# EAGLE design bicyclelab-charger (EAGLE 6.2)
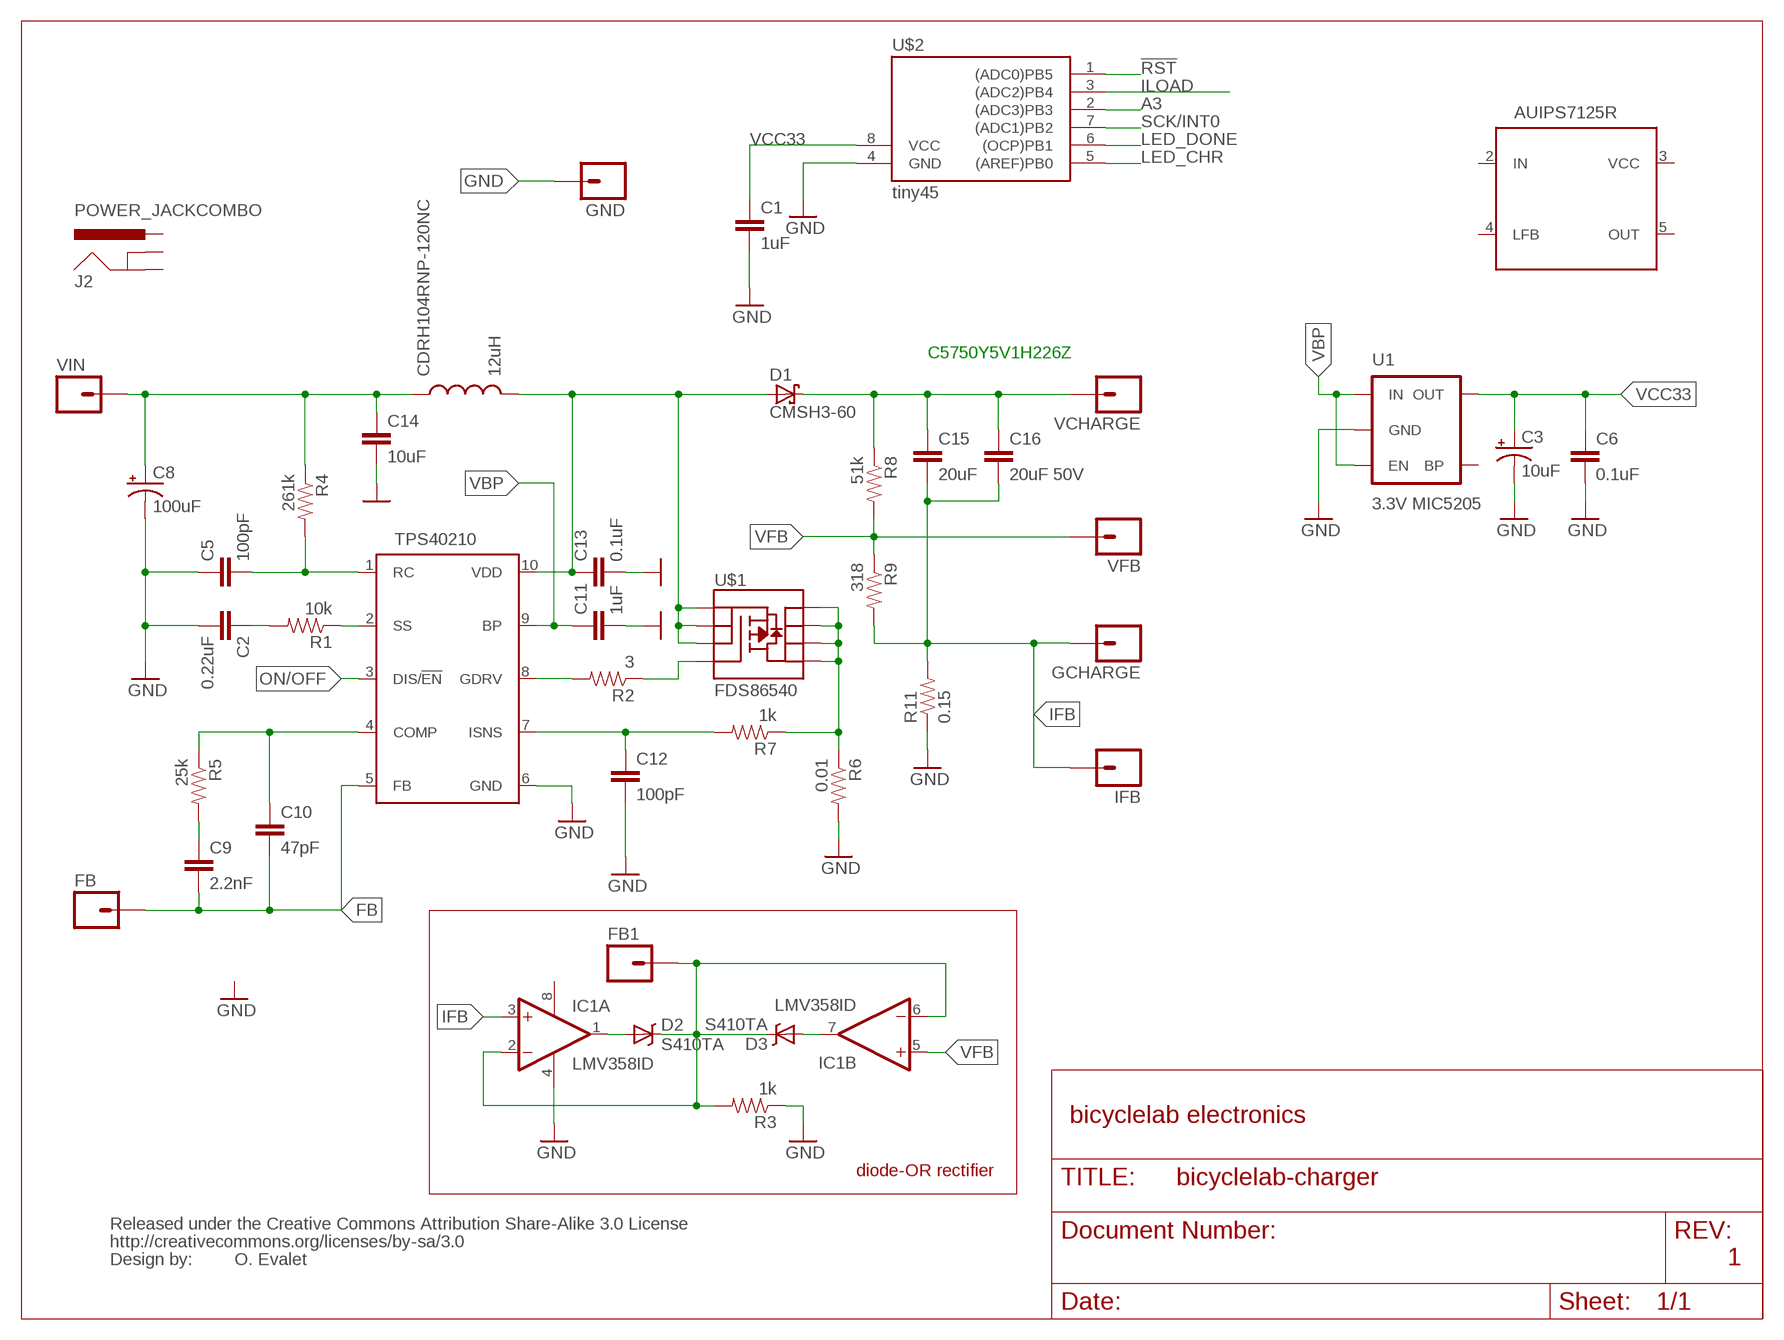
[diagram p0: schematic, sheet 1]

## Parts
11  TPS40211  TPS40210  [MSOP-10-GNDPAD]
C1  1uF  CAP0402-CAP  [0402-CAP]
C2  0.22uF  CAP0402-CAP  [0402-CAP]
C3  10uF  CAP_POL1206  [EIA3216]
C5  100pF  CAP0402-CAP  [0402-CAP]
C6  0.1uF  CAP0603-CAP  [0603-CAP]
C8  100uF  CAP_POLC  [PANASONIC_C]
C9  2.2nF  CAP0402-CAP  [0402-CAP]
C10  47pF  CAP0402-CAP  [0402-CAP]
C11  1uF  CAP0402-CAP  [0402-CAP]
C12  100pF  CAP0402-CAP  [0402-CAP]
C13  0.1uF  CAP0402-CAP  [0402-CAP]
C14  10uF  CAP1206  [1206]
C15  20uF  CAPCAP2220  [C2220K]
C16  20uF 50V  CAPCAP2220  [C2220K]
CDRH104RNP-120NC  12uH  INDUCTORCR75  [CR75]
D1  CMSH3-60  MBRS320T3  [SMC]
D2  S410TA  DIODE-SCHOTTKY  [SOD-323]
D3  S410TA  DIODE-SCHOTTKY  [SOD-323]
FB  M01SMDNS  [1X01NS]
FB1  M01SMDNS  [1X01NS]
GCHARGE  M01SMDNS  [1X01NS]
GND  M01SMDNS  [1X01NS]
IC1  LMV358ID  MCP602SN  [SO08]
IFB  M01SMDNS  [1X01NS]
J2  POWER_JACKCOMBO  [POWER_JACK_COMBO]
R1  10k  RESISTOR0402-RES  [0402-RES]
R2  3  RESISTOR0402-RES  [0402-RES]
R3  1k  RESISTOR0402-RES  [0402-RES]
R4  261k  RESISTOR0402-RES  [0402-RES]
R5  25k  RESISTOR0402-RES  [0402-RES]
R6  0.01  RESISTOR0402-RES  [0402-RES]
R7  1k  RESISTOR0402-RES  [0402-RES]
R8  51k  RESISTOR0402-RES  [0402-RES]
R9  318  RESISTOR0402-RES  [0402-RES]
R11  0.15  RESISTOR0402-RES  [0402-RES]
U1  3.3V MIC5205  V_REG_LDOSMD  [SOT23-5]
U$1  FDS86540  MOSFET-PCHANNEL-SOIC8SOIC8  [SO08]
U$2  tiny45  TINY25/45/85-20SU  [SOIC8]
U$5  CREATIVE_COMMONS  [CREATIVE_COMMONS]
U$8  AUIPS7125R  [DPAK-5]
VCHARGE  M01SMDNS  [1X01NS]
VFB  M01SMDNS  [1X01NS]
VIN  M01SMDNS  [1X01NS]

## Nets
!RST: U$2.1((ADC0)PB5)
A3: U$2.2((ADC3)PB3)
FB: 11.5(FB) C9.2 C10.2 FB.1
FB1: D2.1(C) D3.1(C) FB1.1 IC1.2(A:-IN) IC1.6(B:-IN) R3.2
GND: 11.6(GND) C1.2 C2.2 C3.C(-) C5.1 C6.2 C8.- C11.2 C12.2 C13.2 C14.2 GND.1 IC1.4(P:V-) R3.1 R6.2 R11.1 U1.2(GND) U$2.4(GND)
IFB: C15.2 C16.2 GCHARGE.1 IC1.3(A:+IN) IFB.1 R9.2 R11.2
ILOAD: U$2.3((ADC2)PB4)
LED_CHR: U$2.5((AREF)PB0)
LED_DONE: U$2.6((OCP)PB1)
N$1: C8.+ C14.1 CDRH104RNP-120NC.P$1 R4.1 VIN.1
N$2: 11.1(RC) C5.2 R4.2
N$3: 11.2(SS) R1.1
N$4: C2.1 R1.2
N$5: R2.1 U$1.4(G)
N$6: C15.1 C16.1 D1.C R8.1 VCHARGE.1
N$7: 11.8(GDRV) R2.2
N$8: 11.4(COMP) C10.1 R5.1
N$9: C9.1 R5.2
N$10: D2.2(A) IC1.1(A:OUT)
N$11: 11.10(VDD) C13.1 CDRH104RNP-120NC.P$2 D1.A U$1.1(S) U$1.2(S) U$1.3(S)
N$12: R6.1 R7.1 U$1.5(D) U$1.6(D) U$1.7(D) U$1.8(D)
N$13: 11.7(ISNS) C12.1 R7.2
N$16: D3.2(A) IC1.7(B:OUT)
ON/OFF: 11.3(DIS/!EN)
SCK/INT0: U$2.7((ADC1)PB2)
VBP: 11.9(BP) C11.1 U1.1(IN) U1.3(EN)
VCC33: C1.1 C3.A(+) C6.1 U1.5(OUT) U$2.8(VCC)
VFB: IC1.5(B:+IN) R8.2 R9.1 VFB.1
Unconnected: 11.GND J2.GND(GNDBREAK) J2.GND@1(GND) J2.POWER(PWR) U1.4(BP) U$8.1(NC) U$8.2(IN) U$8.3(VCC) U$8.4(LFB) U$8.5(OUT)

## Notes on the sheet
- C5750Y5V1H226Z
- bicyclelab electronics
- diode-OR rectifier
- O. Evalet | 1

## Power pins joined to a net without a drawn wire
V+: IC1.8(P:V+)

## Library data of the parts
11 = bicyclelab:TPS40210
C1 C2 C5 C6 C9-C13 = SparkFun:CAP: Capacitor Standard 0603 ceramic capacitor, and 0.1" leaded capacitor.
C3 = SparkFun:CAP_POL: Capacitor Polarized These are standard SMD and PTH capacitors. Normally 10uF, 47uF, and 100uF in electrolytic and tantalum varieties. Always verify the external diameter of the through hole cap, it varies with capacity, voltage, and manufacturer. The EIA devices should be standard.
C8 = 0-SparkFun:CAP_POL: Capacitor Polarized These are standard SMD and PTH capacitors. Normally 10uF, 47uF, and 100uF in electrolytic and tantalum varieties. Always verify the external diameter of the through hole cap, it varies with capacity, voltage, and manufacturer. The EIA devices should be standard.
C14 = 0-SparkFun:CAP: Capacitor Standard 0603 ceramic capacitor, and 0.1" leaded capacitor.
C15 C16 = bicyclelab:CAP: Capacitor Standard 0603 ceramic capacitor, and 0.1" leaded capacitor.
CDRH104RNP-120NC = 0-SparkFun:INDUCTOR: Inductors Basic Inductor/Choke - 0603 and 1206. Footprints are not proven and vary greatly between part numbers.
D1 = diode:MBRS3*0T3: SCHOTTKY BARRIER RECTIFIER 3.0 AMPERES 20, 30, 40 VOLT Source: MBRS340T3-D.pdf
D2 D3 = bicyclelab:DIODE-SCHOTTKY: ZLLS410 10V LOW LEAKAGE SCHOTTKY DIODE IN SOD323
FB FB1 GCHARGE GND IFB VCHARGE VFB VIN = SparkFun:M01: Header 1 Standard 1-pin 0.1" header. Use with straight break away headers (SKU : PRT-00116), right angle break away headers (PRT-00553), swiss pins (PRT-00743), machine pins (PRT-00117), and female headers (PRT-00115).
IC1 = linear:MCP602: Single Op Amp 2.7V to 6.0V Single Supply CMOS Source: http://ww1.microchip.com/downloads/en/DeviceDoc/21314g.pdf
J2 = 0-SparkFun:POWER_JACK: Power Jack This is the standard 5.5mm barrel jack for power. The PTH is the most common, proven, reliable, footprint. All others are experimental. The Slot footprint only works if the mill layer is transmitted to the PCB fab house so be warned. Spark Fun Electronics SKU : PRT-00119. Mating wall wart : TOL-00298 (and others)
R1-R9 R11 = SparkFun:RESISTOR: Resistor Basic schematic elements and footprints for 0603, 1206, and PTH 1/10th watt (small) resistors.
U1 = SparkFun:V_REG_LDO: Voltage Regulator LDO Standard 150mA LDO voltage regulator in SOT-23 layout. Micrel part MIC5205. BP (by-pass) pin is used to lower output noise with 470pF cap.
U$1 = 0-SparkFun:MOSFET-PCHANNEL-SOIC8
U$2 = 0-avr-7:TINY25/45/85
U$5 = SparkFun:CREATIVE_COMMONS
U$8 = bicyclelab:AUIPS7125R

## Net classes
0 default: width 0.203 mm
1 power: width 0.508 mm

## Board
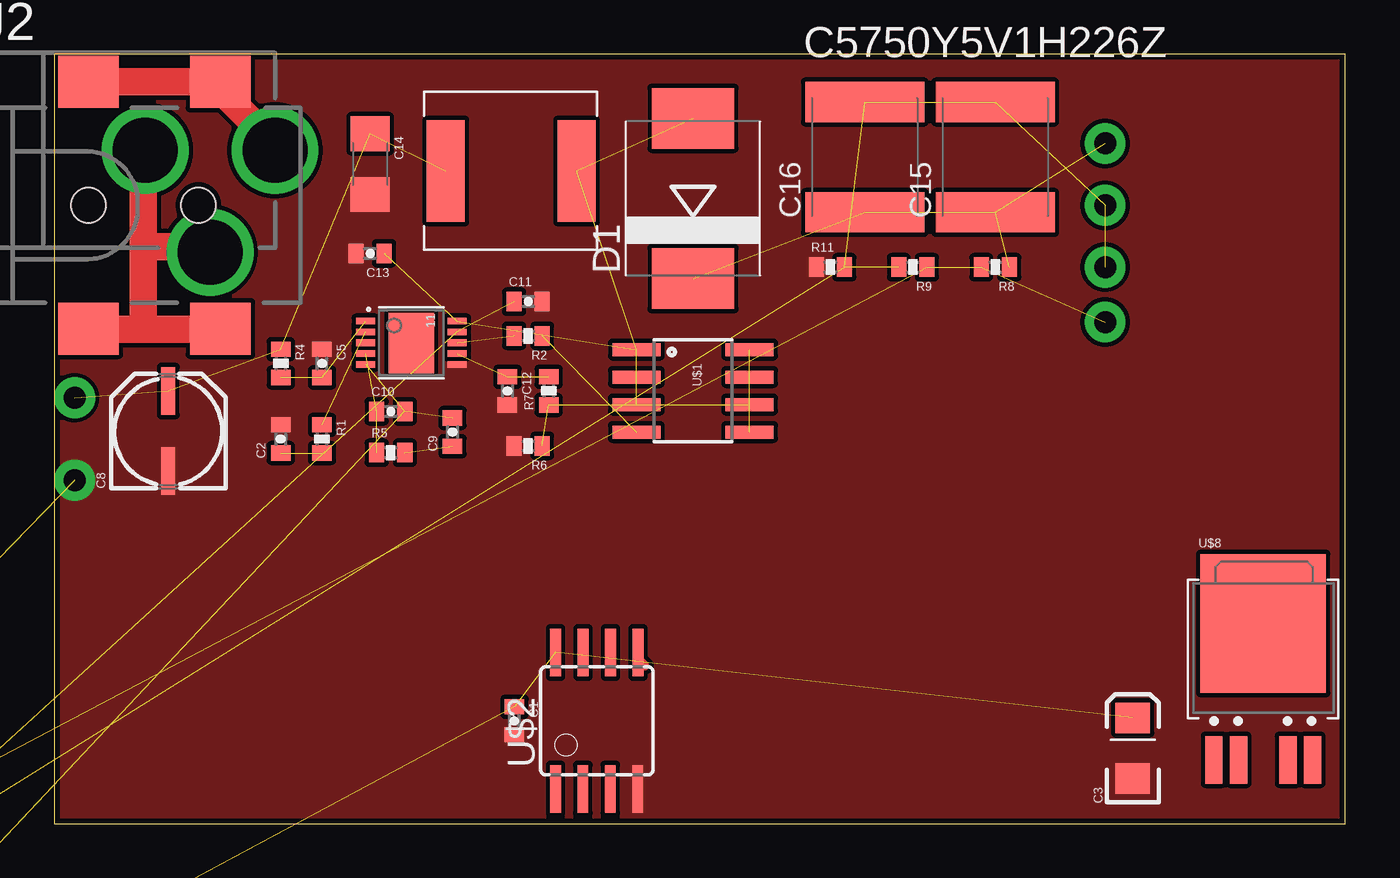
[diagram p1: board, top side]
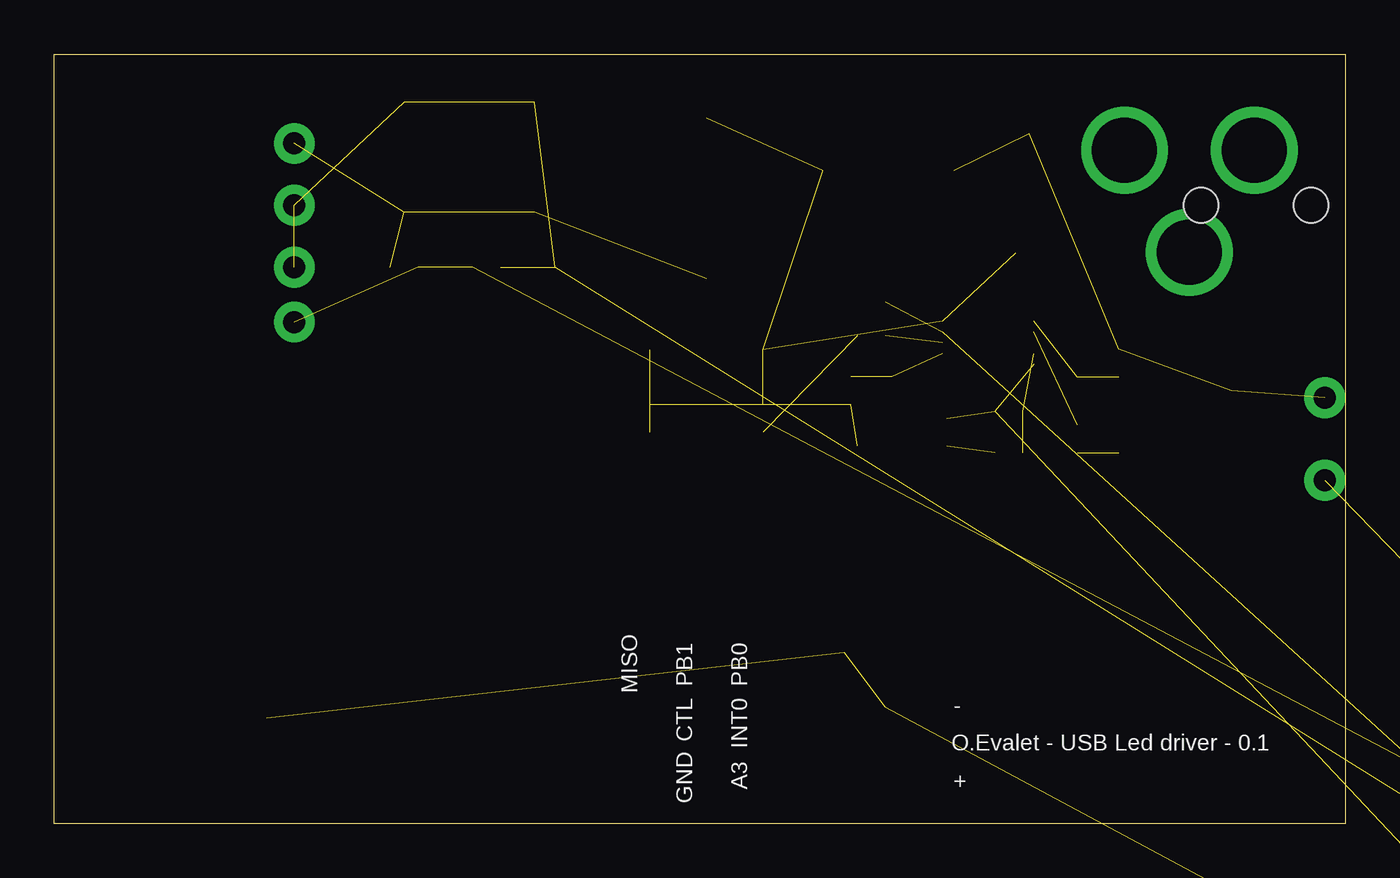
[diagram p2: board, bottom side, seen from below]

Size 59.68 x 35.55 mm. Coordinates in mm from the lower left corner, seen from the top.
Outline: 0,0 59.68,0 59.68,35.55 0,35.55 0,0
Copper layers (1*16): Top 0.035mm / dielectric 1.5mm / Bottom 0.035mm
Design rules: minimum track width 8mil, minimum drill 20mil, track to track 8mil, track to pad 8mil, pad to pad 8mil, via to via 8mil, smd to smd 8mil, copper to edge 10mil, drill to drill 8mil, minimum pad ring 12mil, minimum via ring 10mil, stop-mask expansion 4mil, vias tented up to drill 25mil, thermal gap 10mil

### Footprints (pad centres in the part's own frame; a part is rotated, then mirrored left to right if it is on the bottom)
MSOP-10-GNDPAD = smd 0.305 x 0.889: 1 -1,-2.11; 2 -0.5,-2.11; 3 0,-2.11; 4 0.5,-2.11; 5 1,-2.11; 6 1,2.11; 7 0.5,2.11; 8 0,2.11; 9 -0.5,2.11; 10 -1,2.11 | smd 2.794 x 2.083: GND 0,0
0402-CAP = smd 0.7 x 0.9: 1 -0.65,0; 2 0.65,0
EIA3216 = smd 1.4 x 1.6: A 1.4,0; C -1.4,0
0603-CAP = smd 1.1 x 1: 1 -0.85,0; 2 0.85,0
PANASONIC_C = smd 2.2 x 0.65: + 1.9,-0.2; - -1.8,-0.2
1206 = smd 1.6 x 1.8: 1 -1.4,0; 2 1.4,0
C2220K = smd 1.85 x 5.5: 1 -2.55,0; 2 2.55,0
CR75 = smd 1.75 x 4.7: P$1 0,0; P$2 6.05,0
SMC = smd 2.8 x 3.8: A 3.7,0; C -3.7,0
SOD-323 = smd 0.63 x 0.83: 1 -1.15,0; 2 1.15,0
1X01NS = drill 1.016 pad 1.88: 1 0,0
SO08 = smd 0.6 x 2.2: 1 -1.905,-2.6; 2 -0.635,-2.6; 3 0.635,-2.6; 4 1.905,-2.6; 5 1.905,2.6; 6 0.635,2.6; 7 -0.635,2.6; 8 -1.905,2.6
POWER_JACK_COMBO = drill 2.997: GND 5.62,-2.16; GND@1 2.62,2.54; POWER 8.62,2.54 | smd 2.8 x 2.4: GND@3 0,-5.7; GND@4 6.1,-5.7; POWER@1 0,5.7; POWER@2 6.1,5.7 | hole 1.6: 0,0; 5.08,0
0402-RES = smd 0.7 x 0.9: 1 -0.65,0; 2 0.65,0
SOT23-5 = smd 0.55 x 1.2: 1 -0.95,-1.3; 2 0,-1.3; 3 0.95,-1.3; 4 0.95,1.3; 5 -0.95,1.3
SO08' = smd 0.61 x 2.21: 1 -1.905,-2.616; 2 -0.635,-2.616; 3 0.635,-2.616; 4 1.905,-2.616; 5 1.905,2.616; 6 0.635,2.616; 7 -0.635,2.616; 8 -1.905,2.616
SOIC8 = smd 0.5 x 2.2: 1 -1.905,-3.154; 2 -0.645,-3.154; 3 0.625,-3.154; 4 1.895,-3.154; 5 1.905,3.154; 6 0.635,3.154; 7 -0.635,3.154; 8 -1.905,3.154
DPAK-5 = smd 0.8 x 2.2: 1 -2.28,-5.3; 2 -1.14,-5.3; 4 1.14,-5.3; 5 2.28,-5.3 | smd 5.8 x 6.4: 3 0,1

### Placement (x,y rotation side)
11  16.51,22.23 270 top
C1  21.27,4.76 270 top
C2  10.48,17.78 90 top
C3  49.85,3.49 90 top
C5  12.38,21.27 270 top
C6  -42.23,-37.47 0 top  (outside the outline)
C8  5.08,18.1 90 top
C9  18.41,18.1 90 top
C10  15.56,19.05 0 top
C11  21.91,24.13 0 top
C12  20.95,20 270 top
C13  14.61,26.35 180 top
C14  14.61,30.48 270 top
C15  43.5,30.8 90 top
C16  37.47,30.8 90 top
CDRH104RNP-120NC  18.1,30.16 0 top
D1  29.53,28.89 90 top
D2  -39.05,-22.86 0 top  (outside the outline)
D3  -42.23,-22.86 0 top  (outside the outline)
FB  -42.55,-43.5 0 top  (outside the outline)
FB1  -42.55,-45.72 0 top  (outside the outline)
GCHARGE  48.58,28.57 0 top
GND  0.95,15.88 180 top
IC1  -33.02,-14.61 0 top  (outside the outline)
IFB  48.58,25.72 0 top
J2  1.59,28.57 0 top
R1  12.38,17.78 270 top
R2  21.91,22.54 180 top
R3  -41.91,-26.04 0 top  (outside the outline)
R4  10.48,21.27 270 top
R5  15.56,17.14 0 top
R6  21.91,17.46 180 top
R7  22.86,20 90 top
R8  43.5,25.72 180 top
R9  39.69,25.72 180 top
R11  35.88,25.72 0 top
U1  -42.23,-30.48 0 top  (outside the outline)
U$1  FDS86540  [SO08']  29.53,20 270 top
U$2  25.08,4.76 0 top
U$5  -7.62,-9.84 0 top  (outside the outline)
U$8  55.88,8.26 0 top
VCHARGE  48.58,31.43 0 top
VFB  48.58,23.18 0 top
VIN  0.95,19.68 0 top

### Tracks (layer width: path | path; a pad name or v marks a point on that pad's centre or on a via)
FB  (3 unrouted)
FB1  (5 unrouted)
GND  (4 unrouted)
  pour Top (rank 4, no thermals): 0,35.56 59.69,35.56 59.69,0 0,0
IFB  (6 unrouted)
LED_CHR
  Top 0.406: U$2.5 26.99,7.62 27.3,7.3
N$1  (4 unrouted)
N$2  (2 unrouted)
N$3  (1 unrouted)
N$4  (1 unrouted)
N$5  (1 unrouted)
N$6  (4 unrouted)
N$7  (1 unrouted)
N$8  (2 unrouted)
N$9  (1 unrouted)
N$10  (1 unrouted)
N$11  (6 unrouted)
N$12  (5 unrouted)
N$13  (2 unrouted)
N$16  (1 unrouted)
VBP  (3 unrouted)
VCC33  (4 unrouted)
VFB  (3 unrouted)

### Text on the board
tPlace: C5750Y5V1H226Z
bPlace: PB0 | PB1 | MISO | - | O.Evalet - USB Led driver - 0.1 | CTL | INT0 | + | A3 | GND
tValues: O.Evalet